# Altium schematic sheet LSE_Oscilator.SchDoc
size A4; SheetNumber: 3; SheetTotal: 9
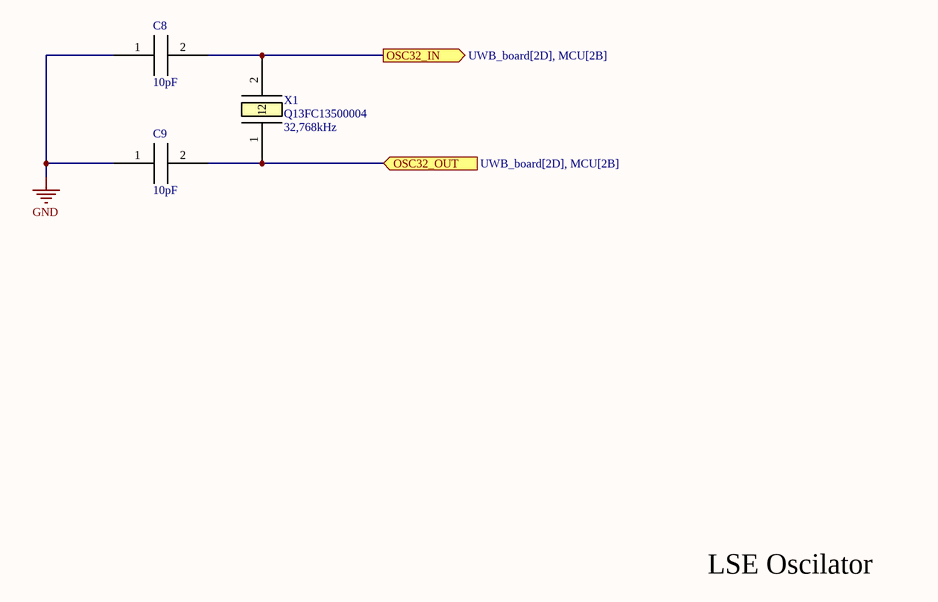
[diagram p0: LSE_Oscilator.SchDoc]

## Parts
C8  10pF  [0603_cap]
C9  10pF  [0603_cap]
X1  Q13FC13500004  Parameter: 32,768kHz  [SMD3215-2P]

## Ports
OSC32_IN (out, see UWB_board[2D], MCU[2B]), OSC32_OUT (in, see UWB_board[2D], MCU[2B])

## Nets
GND: C8.1 C9.1
OSC32_IN: C8.2 X1.2 ; port OSC32_IN
OSC32_OUT: C9.2 X1.1 ; port OSC32_OUT

## Notes on the sheet
- LSE Oscilator

## Library data of the parts
C8 C9 = CL10C100JB8NNNC: 10pF 50V C0G ±5% 0603 Multilayer Ceramic Capacitors MLCC - SMD/SMT ROHS; LCSC Part #: C1634; Value: 10pF
X1 = Q13FC13500004: -40℃~+85℃ 12.5pF 32.768kHz 70kΩ Crystal Oscillator ±20ppm SMD3215-2P Crystals ROHS; ComponentLink1Description: New link; ComponentLink1URL: https://jlcpcb.com/partdetail/SeikoEpson-Q13FC13500004/C32346; LCSC Part #: C32346